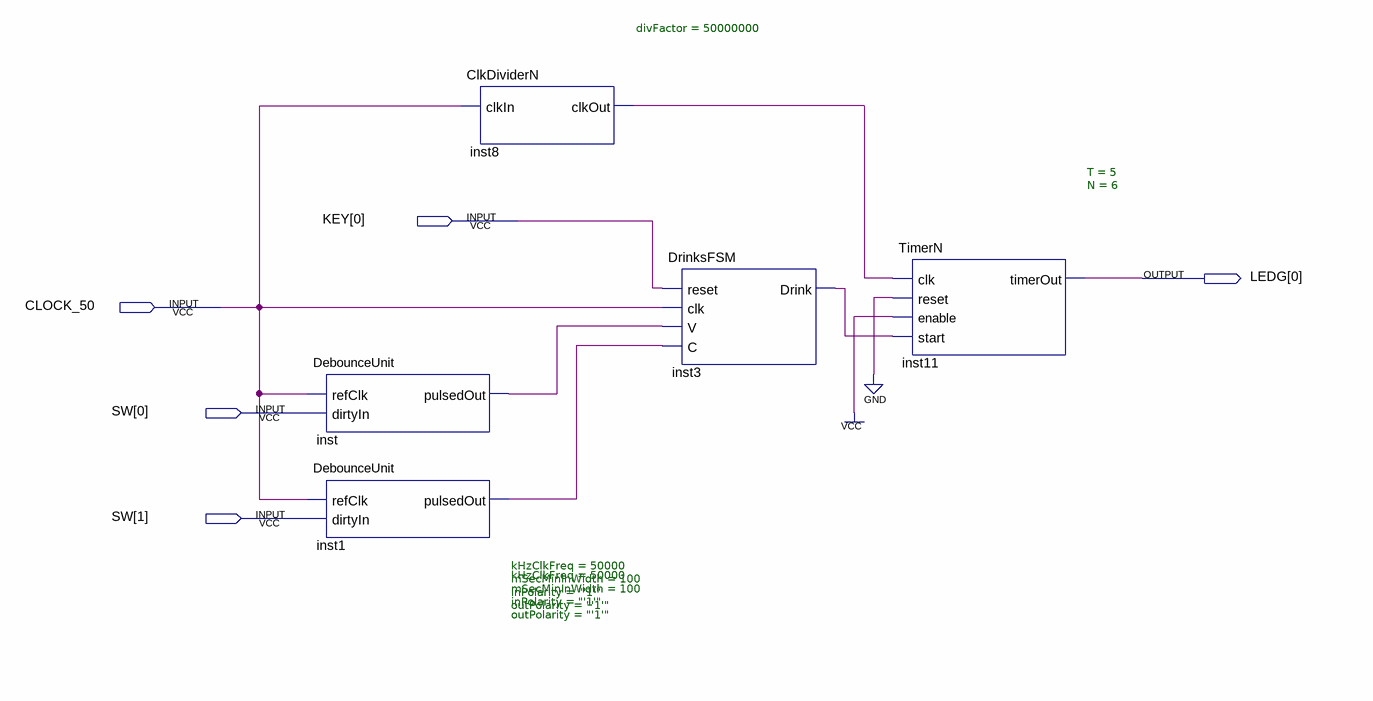
[diagram p0: schematic sheet]
// Quartus schematic DrinksMachine.bdf as structural Verilog: 5 symbols, 5 pins
module DrinksMachine (
  input  [0:0] KEY,
  input  CLOCK_50,
  input  [1:0] SW,
  output [0:0] LEDG
);

  wire inst1_pulsedout, inst3_drink, inst8_clkout, inst_pulsedout;

  DebounceUnit #(.kHzClkFreq(50000), .mSecMinInWidth(100), .inPolarity("'1'"), .outPolarity("'1'")) inst (
    .refClk(CLOCK_50), .dirtyIn(SW[0]), .pulsedOut(inst_pulsedout));
  DebounceUnit #(.kHzClkFreq(50000), .mSecMinInWidth(100), .inPolarity("'1'"), .outPolarity("'1'")) inst1 (
    .refClk(CLOCK_50), .dirtyIn(SW[1]), .pulsedOut(inst1_pulsedout));
  ClkDividerN #(.divFactor(50000000)) inst8 (.clkIn(CLOCK_50), .clkOut(inst8_clkout));
  DrinksFSM inst3 (.reset(KEY[0]), .clk(CLOCK_50), .V(inst_pulsedout), .C(inst1_pulsedout), .Drink(inst3_drink));
  TimerN #(.T(5), .N(6)) inst11 (
    .clk(inst8_clkout), .reset(1'b0), .enable(1'b1), .start(inst3_drink), .timerOut(LEDG[0]));
endmodule
